# EasyEDA Pro project Ligaçao de LED_transistor_botao.eprj

# Schematic Schematic1
Create Date: 2025-03-27; Page Name: P1; Project Name: Ligaçao de LED_transistor_botao; Schematic Name: Schematic1; Update Date: 2025-03-27
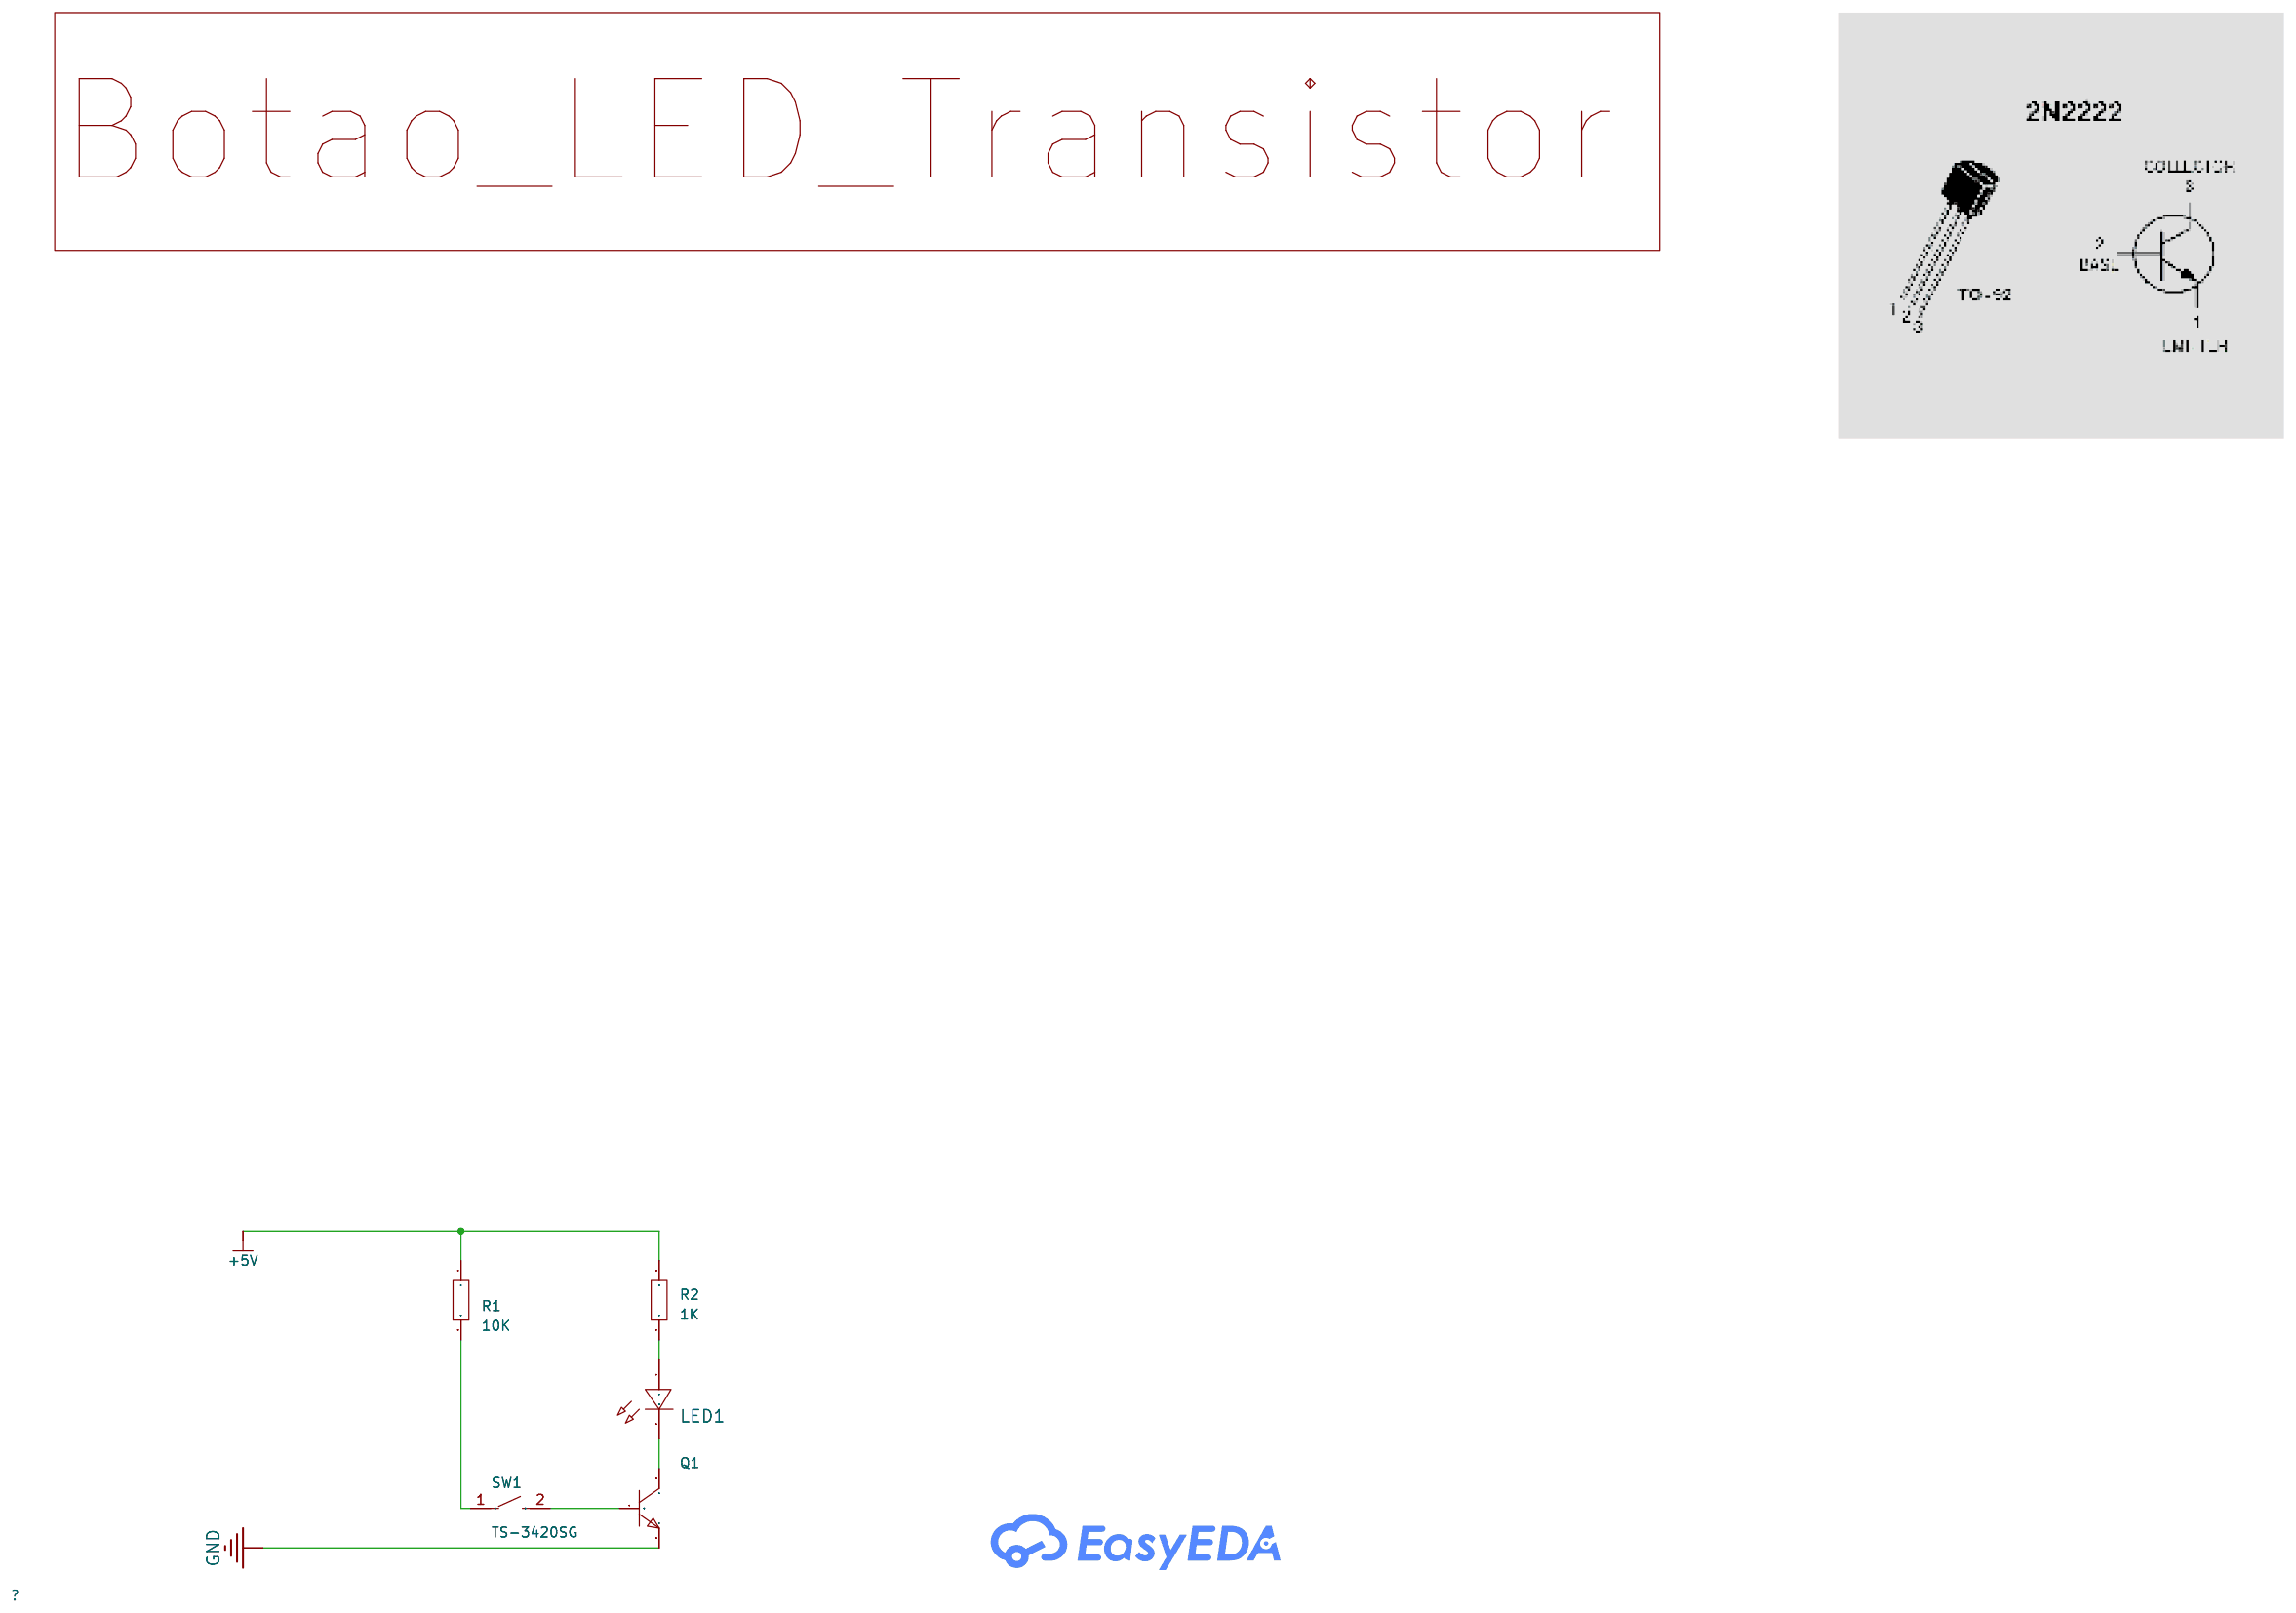
[diagram p0: schematic sheet]

## Parts
LED1  -  [LED0402-RD_YELLOW]
Q1  -  [TO-92-3_L4.9-W3.7-P1.27-L]
R1  10K  [R0603]
R2  1K  [R0603]
SW1  TS-3420SG  [SW-SMD_TS-3420SG]

## Library data of the parts
LED1 = LED_0402-R: Supplier Footprint: 0402
Q1 = S8050_NPN: Supplier Footprint: TO-92
R1 R2 = Res_0603: Supplier Footprint: 0603
SW1 = TS-3420SG: LCSC Part Name: 3*4*2mm 二脚小龟 轻触开关 黑圆键 弹力250gf 编带; Supplier Part: C19779115; Manufacturer: 康深; Supplier Footprint: SMD,3.9x2.5mm; JLCPCB Part Class: Extended Part; Datasheet: https://atta.szlcsc.com/upload/public/pdf/source/20231226/B2DC8EDDC77954C7935DE5F3966C6317.pdf; Supplier: LCSC; Operating Force: 250gf; Length: 4mm; Width: 3mm; Switch Height: 2mm; Actuator/Cap Color: Black; Life: 50,000 times

## Nets
+5V: R1.1 R2.2
GND: Q1.2(E)
Net-(LED1-1): LED1.1(A) R2.1
Net-(LED1-2): LED1.2(C) Q1.3(C)
Net-(Q1-1): Q1.1(B) SW1.2
Net-(R1-2): R1.2 SW1.1
